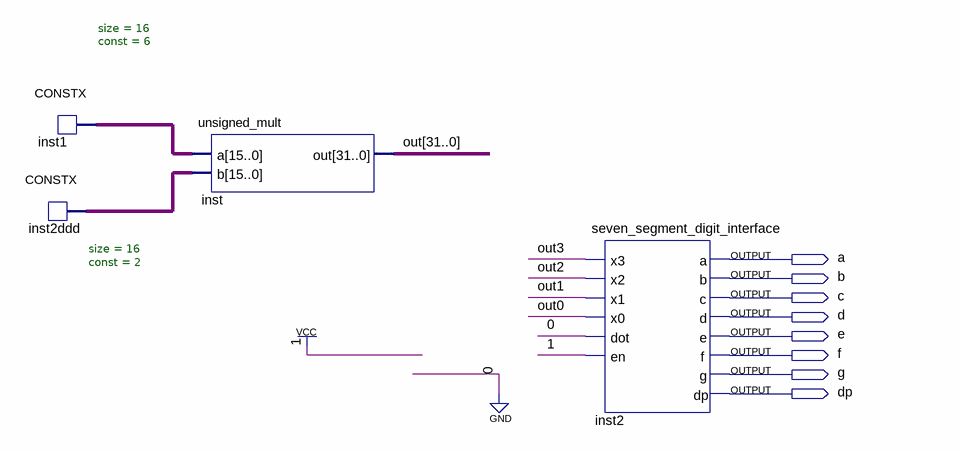
[diagram p0: schematic sheet]
// Quartus schematic main.bdf as structural Verilog: 4 symbols, 8 pins
module main (
  output a,
  output b,
  output c,
  output d,
  output e,
  output f,
  output g,
  output dp
);

  wire [15:0] inst1_data, inst2ddd_data;
  wire [31:0] out;

  CONSTX #(.size(16), .\const (6)) inst1 (.data(inst1_data));
  CONSTX #(.size(16), .\const (2)) inst2ddd (.data(inst2ddd_data));
  unsigned_mult inst (.a(inst1_data), .b(inst2ddd_data), .out(out));
  seven_segment_digit_interface inst2 (
    .x3(out[3]), .x2(out[2]), .x1(out[1]), .x0(out[0]), .dot(1'b0), .en(1'b1), .a(a), .b(b), .c(c), .d(d),
    .e(e), .f(f), .g(g), .dp(dp));
endmodule
